# Altium schematic sheet STM32_LineFlow.SchDoc
size A3; SheetNumber: 1; SheetTotal: 1
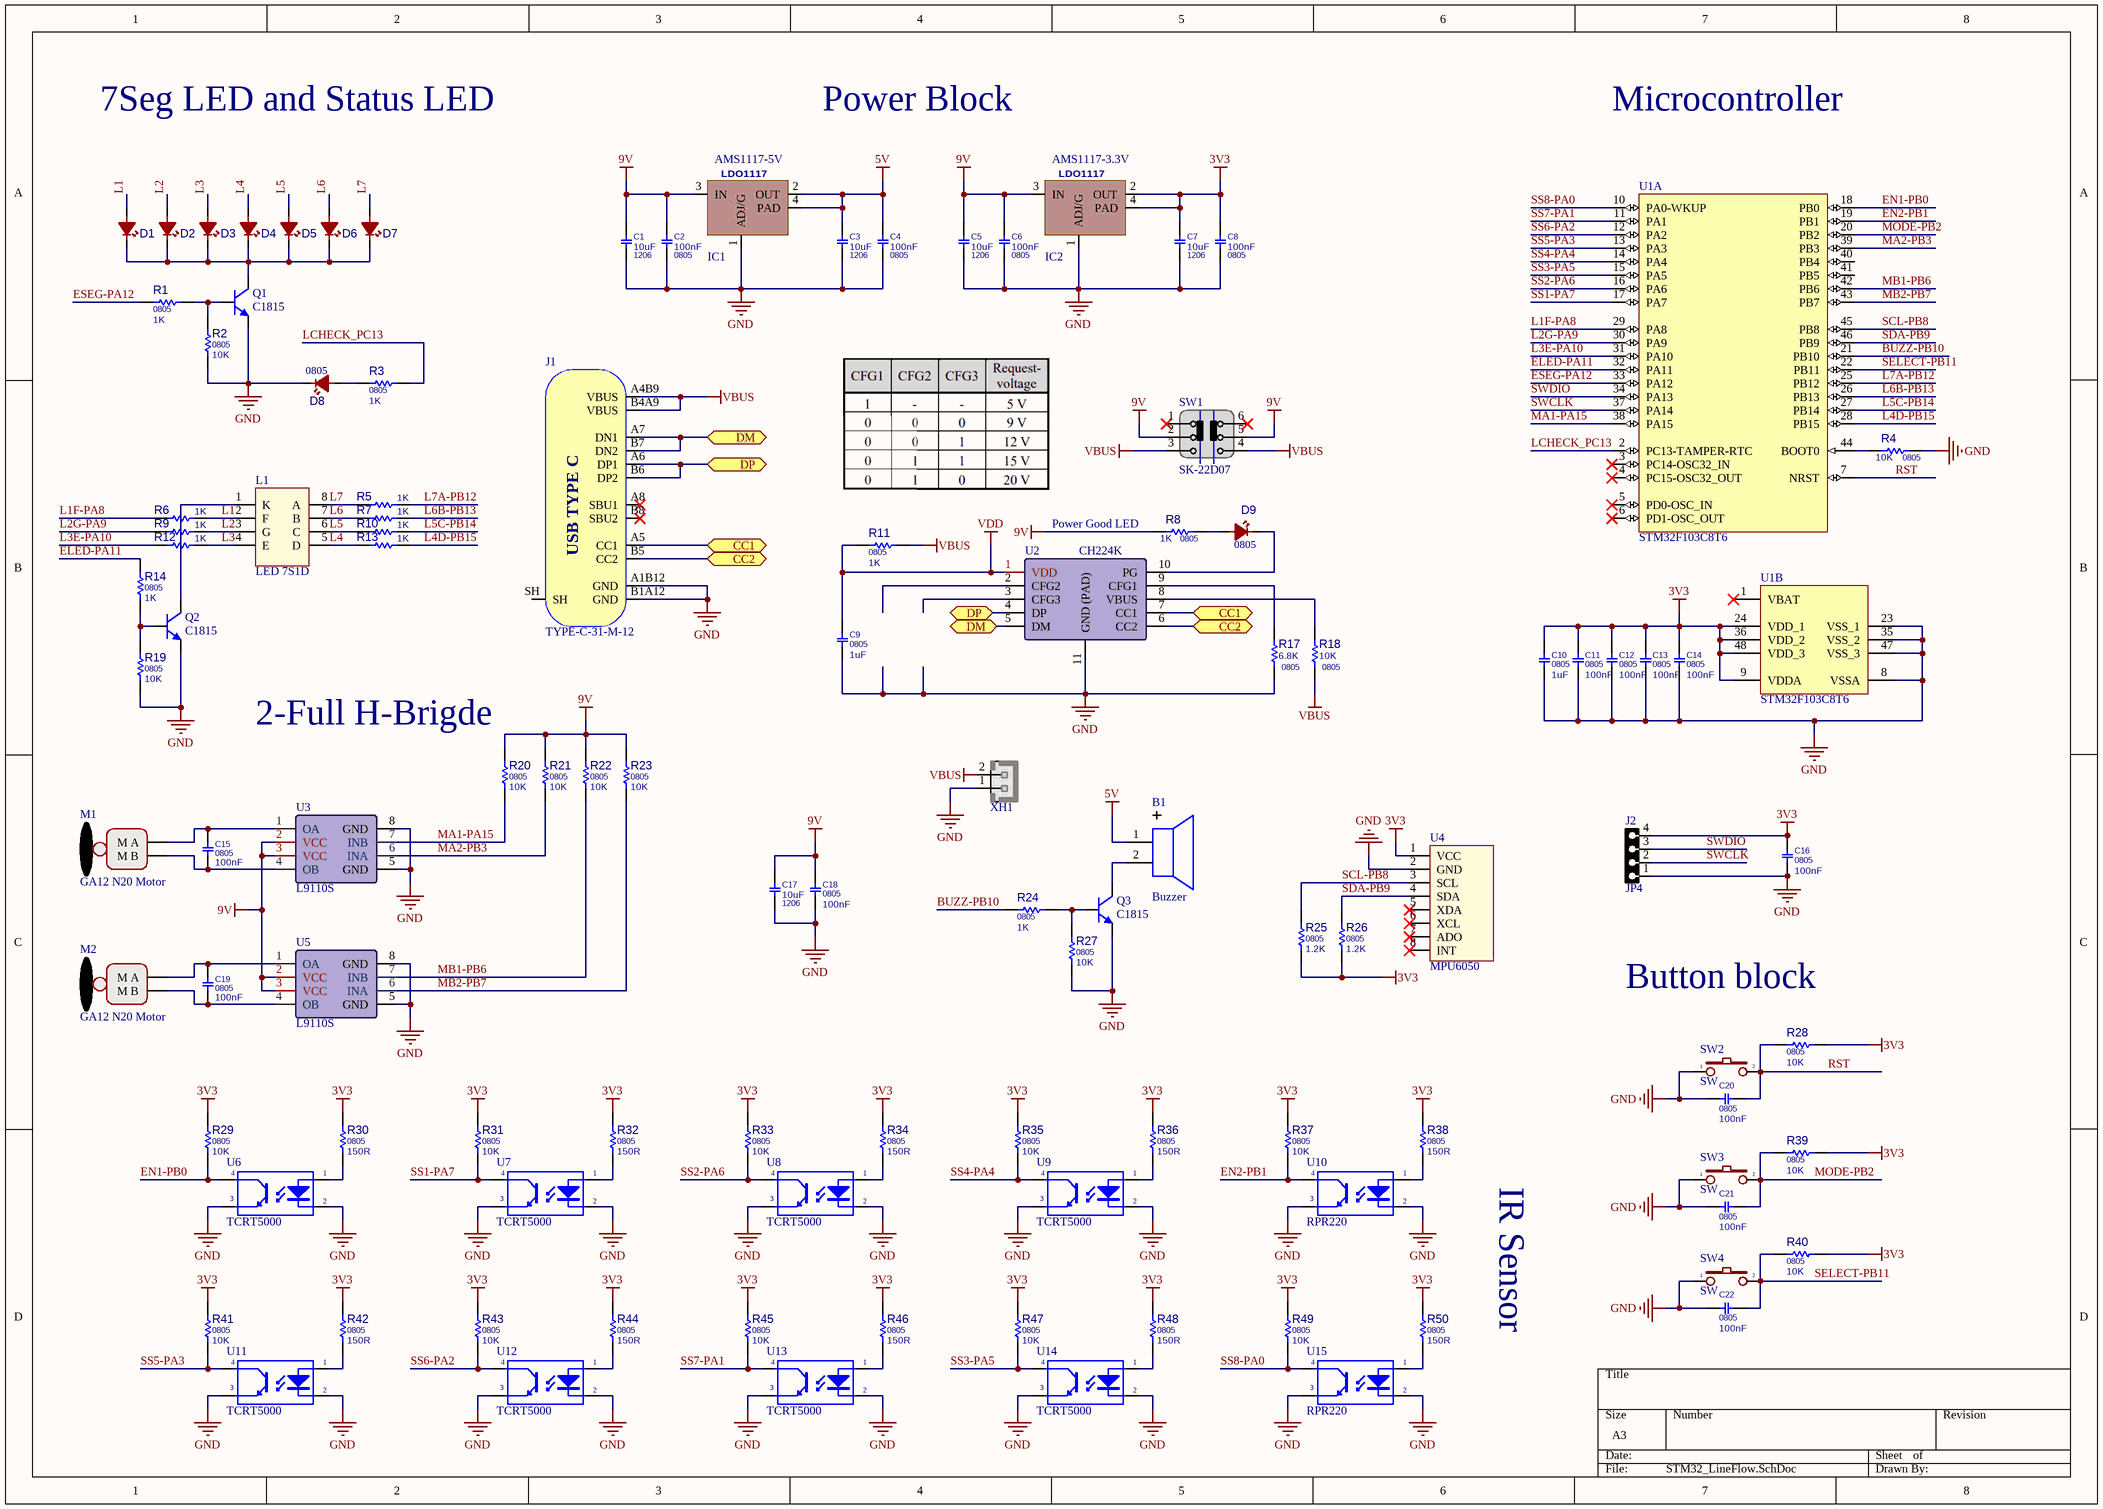
[diagram p0: STM32_LineFlow.SchDoc]

## Parts
B1  Buzzer  [Buzzer]
C1  1206  value 10uF  [cap_1206]
C2  0805  value 100nF  [cap_0805]
C3  1206  value 10uF  [cap_1206]
C4  0805  value 100nF  [cap_0805]
C5  1206  value 10uF  [cap_1206]
C6  0805  value 100nF  [cap_0805]
C7  1206  value 10uF  [cap_1206]
C8  0805  value 100nF  [cap_0805]
C9  0805  value 1uF  [cap_0805]
C10  0805  value 1uF  [cap_0805]
C11  0805  value 100nF  [cap_0805]
C12  0805  value 100nF  [cap_0805]
C13  0805  value 100nF  [cap_0805]
C14  0805  value 100nF  [cap_0805]
C15  0805  value 100nF  [cap_0805]
C16  0805  value 100nF  [cap_0805]
C17  1206  value 10uF  [cap_1206]
C18  0805  value 100nF  [cap_0805]
C19  0805  value 100nF  [cap_0805]
C20  0805  value 100nF  [cap_0805]
C21  0805  value 100nF  [cap_0805]
C22  0805  value 100nF  [cap_0805]
D1  0805  [LED0805RED]  (value not drawn)
D2  0805  [LED0805RED]  (value not drawn)
D3  0805  [LED0805RED]  (value not drawn)
D4  0805  [LED0805RED]  (value not drawn)
D5  0805  [LED0805RED]  (value not drawn)
D6  0805  [LED0805RED]  (value not drawn)
D7  0805  [LED0805RED]  (value not drawn)
D8  0805  [LED0805RED]
D9  0805  [LED0805RED]
IC1  AMS1117-5V  [SOT223]
IC2  AMS1117-3.3V  [SOT223]
J1  TYPE-C-31-M-12  [TYPE-C-31-M-12]
J2  JP4  [JP_4PIN]
L1  LED 7S1D  [LED 7S1D 0.28"]
M1  GA12 N20 Motor  [Motor GA-12 Type3]
M2  GA12 N20 Motor  [Motor GA-12 Type2]
Q1  C1815  [2SC1815-HF]
Q2  C1815  [2SC1815-HF]
Q3  C1815  [2SC1815-HF]
R1  0805  value 1K  [R0805]
R2  0805  value 10K  [R0805]
R3  0805  value 1K  [R0805]
R4  0805  value 10K  [R0805]
R5  value 1K  [R0805]  (hidden comment: 0805)
R6  value 1K  [R0805]  (hidden comment: 0805)
R7  value 1K  [R0805]  (hidden comment: 0805)
R8  0805  value 1K  [R0805]
R9  value 1K  [R0805]  (hidden comment: 0805)
R10  value 1K  [R0805]  (hidden comment: 0805)
R11  0805  value 1K  [R0805]
R12  value 1K  [R0805]  (hidden comment: 0805)
R13  value 1K  [R0805]  (hidden comment: 0805)
R14  0805  value 1K  [R0805]
R17  0805  value 6.8K  [R0805]
R18  0805  value 10K  [R0805]
R19  0805  value 10K  [R0805]
R20  0805  value 10K  [R0805]
R21  0805  value 10K  [R0805]
R22  0805  value 10K  [R0805]
R23  0805  value 10K  [R0805]
R24  0805  value 1K  [R0805]
R25  0805  value 1.2K  [R0805]
R26  0805  value 1.2K  [R0805]
R27  0805  value 10K  [R0805]
R28  0805  value 10K  [R0805]
R29  0805  value 10K  [R0805]
R30  0805  value 150R  [R0805]
R31  0805  value 10K  [R0805]
R32  0805  value 150R  [R0805]
R33  0805  value 10K  [R0805]
R34  0805  value 150R  [R0805]
R35  0805  value 10K  [R0805]
R36  0805  value 150R  [R0805]
R37  0805  value 10K  [R0805]
R38  0805  value 150R  [R0805]
R39  0805  value 10K  [R0805]
R40  0805  value 10K  [R0805]
R41  0805  value 10K  [R0805]
R42  0805  value 150R  [R0805]
R43  0805  value 10K  [R0805]
R44  0805  value 150R  [R0805]
R45  0805  value 10K  [R0805]
R46  0805  value 150R  [R0805]
R47  0805  value 10K  [R0805]
R48  0805  value 150R  [R0805]
R49  0805  value 10K  [R0805]
R50  0805  value 150R  [R0805]
SW1  SK-22D07  [SK-22D07]
SW2  SW  [SW-SMD]
SW3  SW  [SW-SMD]
SW4  SW  [SW-SMD]
U1  STM32F103C8T6  [STM-LQFP48_N]  (parts A,B of 2)
U2  CH224K  [ESOP-10 CHAY]
U3  L9110S  [SOIC-8]
U4  MPU6050  [MPU-6050]
U5  L9110S  [SOIC-8]
U6  TCRT5000  [TCRT5000]
U7  TCRT5000  [TCRT5000]
U8  TCRT5000  [TCRT5000]
U9  TCRT5000  [TCRT5000]
U10  RPR220  [RPR220]
U11  TCRT5000  [TCRT5000]
U12  TCRT5000  [TCRT5000]
U13  TCRT5000  [TCRT5000]
U14  TCRT5000  [TCRT5000]
U15  RPR220  [RPR220]
XH1  HHDR_2  [XH_2]  (value not drawn)

## Ports
CC1 (bidir, see STM32_LineFlow[3B]), CC1 (bidir, see STM32_LineFlow[5B]), CC2 (bidir, see STM32_LineFlow[3B]), CC2 (bidir, see STM32_LineFlow[5B]), DM (bidir, see STM32_LineFlow[3B]), DM (bidir, see STM32_LineFlow[4B]), DP (bidir, see STM32_LineFlow[3B]), DP (bidir, see STM32_LineFlow[4B])

## Nets
3V3: C7.2 C8.2 C10.2 C11.2 C12.2 C13.2 C14.2 C16.2 IC2.2(OUT) IC2.4(PAD) J2.4 R25.1 R26.1 R28.1 R29.2 R30.2 R31.2 R32.2 R33.2 R34.2 R35.2 R36.2 R37.2 R38.2 R39.1 R40.1 R41.2 R42.2 R43.2 R44.2 R45.2 R46.2 R47.2 R48.2 R49.2 R50.2 U1.9(VDDA) U1.24(VDD_1) U1.36(VDD_2) U1.48(VDD_3) U4.1(VCC)
5V: B1.1(+) C3.2 C4.2 IC1.2(OUT) IC1.4(PAD)
9V: C1.2 C2.2 C5.2 C6.2 C17.2 C18.2 IC1.3(IN) IC2.3(IN) R8.1 R20.2 R21.2 R22.2 R23.2 SW1.2(P3) SW1.5(P3) U3.2(VCC) U3.3(VCC) U5.2(VCC) U5.3(VCC)
GND: C1.1 C2.1 C3.1 C4.1 C5.1 C6.1 C7.1 C8.1 C9.1 C10.1 C11.1 C12.1 C13.1 C14.1 C16.1 C17.1 C18.1 C20.2 C21.2 C22.2 D8.2(K) IC1.1(ADJ/G) IC2.1(ADJ/G) J1.A1B12(GND) J1.B1A12(GND) J2.1 Q1.1(E) Q2.1(E) Q3.1(E) R2.1 R4.1 R17.1 R19.1 R27.1 SW2.1 SW3.1 SW4.1 U1.8(VSSA) U1.23(VSS_1) U1.35(VSS_2) U1.47(VSS_3) U2.11(GND_(PAD)) U3.5(GND) U3.8(GND) U4.2(GND) U5.5(GND) U5.8(GND) U6.2(K) U6.3(E) U7.2(K) U7.3(E) U8.2(K) U8.3(E) U9.2(K) U9.3(E) U10.2(K) U10.3(E) U11.2(K) U11.3(E) U12.2(K) U12.3(E) U13.2(K) U13.3(E) U14.2(K) U14.3(E) U15.2(K) U15.3(E) XH1.1
VBUS: J1.A4B9(VBUS) J1.B4A9(VBUS) R11.2 R18.1 SW1.3(P4) SW1.4(P4) XH1.2
VDD: C9.2 R11.1 U2.1(VDD)
BUZZ-PB10: R24.1 U1.21(PB10)
CC1: J1.A5(CC1) U2.7(CC1) ; port CC1
CC2: J1.B5(CC2) U2.6(CC2) ; port CC2
DM: J1.A7(DN1) J1.B7(DN2) U2.5(DM) ; port DM
DP: J1.A6(DP1) J1.B6(DP2) U2.4(DP) ; port DP
ELED-PA11: R14.1 U1.32(PA11)
EN1-PB0: R29.1 U1.18(PB0) U6.4(C)
EN2-PB1: R37.1 U1.19(PB1) U10.4(C)
ESEG-PA12: R1.1 U1.33(PA12)
L1: D1.1(A) L1.2(F) R6.1
L1F-PA8: R6.2 U1.29(PA8)
L2: D2.1(A) L1.3(G) R9.1
L2G-PA9: R9.2 U1.30(PA9)
L3: D3.1(A) L1.4(E) R12.1
L3E-PA10: R12.2 U1.31(PA10)
L4: D4.1(A) L1.5(D) R13.2
L4D-PB15: R13.1 U1.28(PB15)
L5: D5.1(A) L1.6(C) R10.2
L5C-PB14: R10.1 U1.27(PB14)
L6: D6.1(A) L1.7(B) R7.2
L6B-PB13: R7.1 U1.26(PB13)
L7: D7.1(A) L1.8(A) R5.2
L7A-PB12: R5.1 U1.25(PB12)
LCHECK_PC13: R3.1 U1.2(PC13-TAMPER-RTC)
MA1-PA15: R20.1 U1.38(PA15) U3.7(INB)
MA2-PB3: R21.1 U1.39(PB3) U3.6(INA)
MB1-PB6: R22.1 U1.42(PB6) U5.7(INB)
MB2-PB7: R23.1 U1.43(PB7) U5.6(INA)
MODE-PB2: C21.1 R39.2 SW3.2 U1.20(PB2)
RST: C20.1 R28.2 SW2.2 U1.7(NRST)
SCL-PB8: R25.2 U1.45(PB8) U4.3(SCL)
SDA-PB9: R26.2 U1.46(PB9) U4.4(SDA)
SELECT-PB11: C22.1 R40.2 SW4.2 U1.22(PB11)
SS1-PA7: R31.1 U1.17(PA7) U7.4(C)
SS2-PA6: R33.1 U1.16(PA6) U8.4(C)
SS3-PA5: R47.1 U1.15(PA5) U14.4(C)
SS4-PA4: R35.1 U1.14(PA4) U9.4(C)
SS5-PA3: R41.1 U1.13(PA3) U11.4(C)
SS6-PA2: R43.1 U1.12(PA2) U12.4(C)
SS7-PA1: R45.1 U1.11(PA1) U13.4(C)
SS8-PA0: R49.1 U1.10(PA0-WKUP) U15.4(C)
SWCLK: J2.2 U1.37(PA14)
SWDIO: J2.3 U1.34(PA13)
NetB1_2: B1.2(-) Q3.2(C)
NetC15_1: C15.1 M1.M_B U3.4(OB)
NetC15_2: C15.2 M1.M_A U3.1(OA)
NetC19_1: C19.1 M2.M_B U5.4(OB)
NetC19_2: C19.2 M2.M_A U5.1(OA)
NetD1_2: D1.2(K) D2.2(K) D3.2(K) D4.2(K) D5.2(K) D6.2(K) D7.2(K) Q1.2(C)
NetD8_1: D8.1(A) R3.2
NetD9_1: D9.1(A) R8.2
NetD9_2: D9.2(K) U2.10(PG)
NetL1_1: L1.1(K) Q2.2(C)
NetQ1_3: Q1.3(B) R1.2 R2.2
NetQ2_3: Q2.3(B) R14.2 R19.2
NetQ3_3: Q3.3(B) R24.2 R27.2
NetR4_2: R4.2 U1.44(BOOT0)
NetR17_2: R17.2 U2.9(CFG1)
NetR18_2: R18.2 U2.8(VBUS)
NetR30_1: R30.1 U6.1(A)
NetR32_1: R32.1 U7.1(A)
NetR34_1: R34.1 U8.1(A)
NetR36_1: R36.1 U9.1(A)
NetR38_1: R38.1 U10.1(A)
NetR42_1: R42.1 U11.1(A)
NetR44_1: R44.1 U12.1(A)
NetR46_1: R46.1 U13.1(A)
NetR48_1: R48.1 U14.1(A)
NetR50_1: R50.1 U15.1(A)

Not connected (* = marked no-connect by the designer): J1 A8(SBU1)* B8(SBU2)* SH; SW1 1(P1)* 6(P1)*; U1 1(VBAT)* 3(PC14-OSC32_IN)* 4(PC15-OSC32_OUT)* 5(PD0-OSC_IN)* 6(PD1-OSC_OUT)* 40(PB4) 41(PB5); U2 2(CFG2) 3(CFG3); U4 5(XDA)* 6(XCL)* 7(ADO)* 8(INT)*

## Notes on the sheet
- 7Seg LED and Status LED
- Power Block
- Microcontroller
- Power Good LED
- 2-Full H-Brigde
- Button block
- IR Sensor
- (in symbol LDO 1117) LDO1117
- (in symbol TYPE-C-31-M-12) USB TYPE C

## Library data of the parts
C1-C22 = CAP SMD: PARAM: -, -%; MANF_P#: MANF_PART#; PARAM2: -V; PRICE: 100= 1$; MANF: -; ASSEMBLY: ASSEMBLY
D1-D9 = LED Red SMD: DESC: DESCRIPTION; MANF_P#: MANF_PART#; PARAM2: 2.2V; MANF: MANF; ASSEMBLY: ASSEMBLY; PRICE: 36t@Javan
IC1 IC2 = LDO 1117: LDO 1117 Available in 1.8V, 2.5V, 2.85V, 3.3V, 5V, and  Adjustable Versions; Value: LM317
J1 = TYPE-C-31-M-12: USB Type C Connector Horizontal SMT; Manufacturer: Koren Hroparts; Manufacturer Part Number: TYPE-C-31-M-12; LCSC: C165948
M1 M2 = GA12 N20 Motor: GA12 N20 Metal Gear Motor
Q1-Q3 = BJT 2SC1815: BJT C1815 Trans NPN 50V 150mA TO-92; ComponentLink1Description: Datasheet; ComponentLink1URL: D:\Dropbox\Datasheets\Transistors\P Channel Bipolar\2SC1815.pdf; Unit Price: 0.0143
R1-R14 R17-R50 = RES SMD: MANF_P#: WSLP0805R0100FEA; MANF: VISHAY; PARAM: 0.5W, -55~155oC; DESC: DESCRIPTION; DIST#: MOUSER; PARAM2: 1%; ASSEMBLY: ASSEMBLY; PRICE: 0.5$
SW1 = SW SK-22D07: SW SK-22D07 Công Tắc Trượt 6 Chân Xuyên Lỗ ON-ON 2P2T 1A
SW2-SW4 = SW2: Switch button 2 pin; Value: SW chip 2 pin
U1 = STM32F103C8T6AB: ARM Cortex-M3 32-bit MCU, 64 KB Flash, 20 KB Internal RAM, 37 I/Os, 48-pin LQFP, -40 to 85 degC, Tray; A/D Converter: 2x12-bit (10 Channel); FLASH Size (Prog) (kB): 64; I/Os (High Current): 37; Internal RAM Size (kB): 20; Operating Frequency(F) (Processor speed) (MHz): 72; Supply Voltage(Vcc) min (V): 2; DatasheetVersion: Rev. 16; PackageVersion: Rev. 6, 06/2013; PackageReference: LQFP48; PackageDescription: 48-Pin Low Profile Quad Flat Package, 7 x 7 mm Body, 0.5 mm Pitch; Supplier 1: Digi-Key; Supplier Part Number 1: 497-6063-ND; Supplier 2: Farnell; Supplier Part Number 2: 1447637; Supplier 3: Newark; Supplier Part Number 3: 59M2182; Supplier 4: Newark; Supplier Part Number 4: 57P1222; Supplier 5: Mouser; Supplier Part Number 5: 511-STM32F103C8T6; Core: ARM Cortex-M3; Packing: Tray; Mounting Technology: Surface Mount; PartNumber: STM32F103C8T6; ComponentLink1Description: Manufacturer URL; ComponentLink1URL: http://www.st.com/web/en/home.html; ComponentLink2Description: Datasheet; ComponentLink2URL: http://www.st.com/st-web-ui/static/active/en/resource/technical/document/datasheet/CD00161566.pdf; ComponentLink3Description: Package Specification; ComponentLink3URL: http://www.st.com/st-web-ui/static/active/en/resource/technical/document/datasheet/DM00058181.pdf
U2 = CH224K: CH224K USB PD Decoy, USB Power Delivery Decoy
U3 U5 = L9110
U4 = MPU6050: MPU6050 Module
U6-U9 U11-U14 = TCRT5000: TCRT5000 Cảm Biến Hồng Ngoại Phản Xạ
XH1 = XH_2: XH 2 JST-XH pitch: 2.5mm; VALUE: HHDR_2